# EAGLE design BUZZI-19 (EAGLE 4.15)
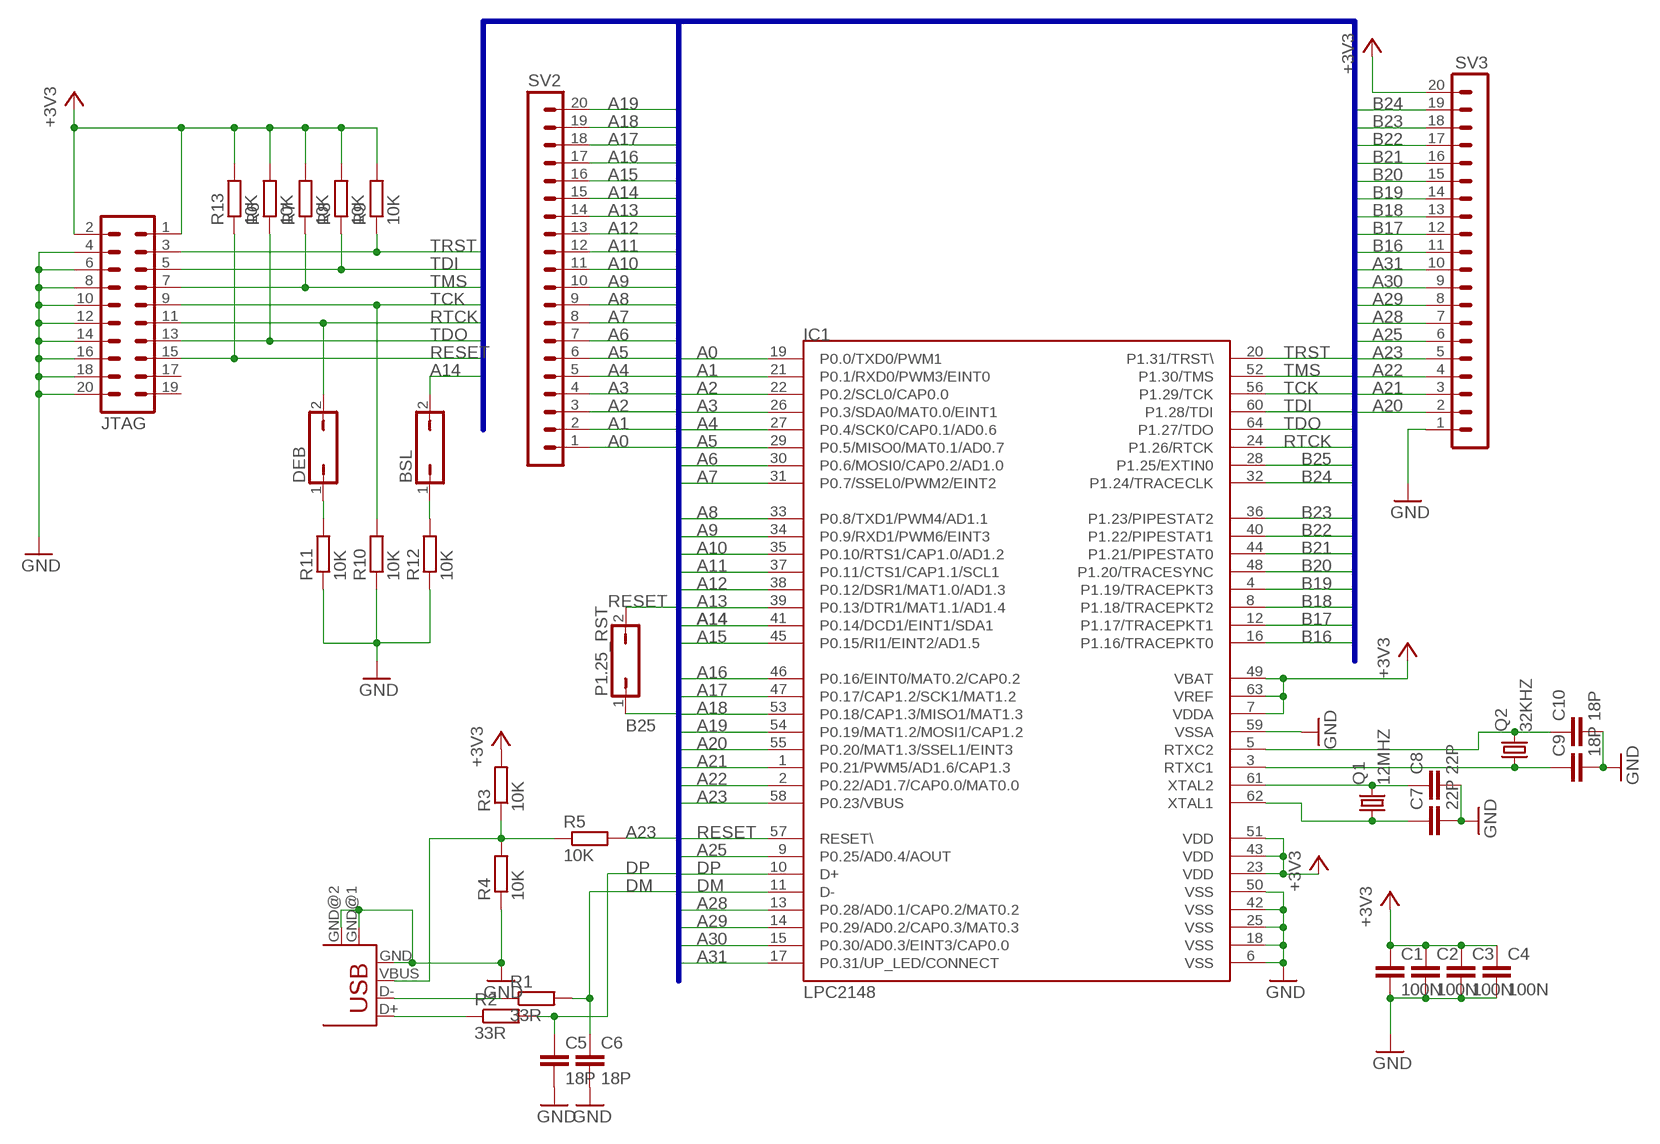
[diagram p0: schematic, sheet 1]

## Parts
BSL  JP1Q  [JP1]
C1  100N  C-EUC0805  [C0805]
C2  100N  C-EUC0805  [C0805]
C3  100N  C-EUC0805  [C0805]
C4  100N  C-EUC0805  [C0805]
C5  18P  C-EUC0805  [C0805]
C6  18P  C-EUC0805  [C0805]
C7  22P  C-EUC0805  [C0805]
C8  22P  C-EUC0805  [C0805]
C9  18P  C-EUC0805  [C0805]
C10  18P  C-EUC0805  [C0805]
DEB  JP1Q  [JP1]
IC1  LPC2148  LPC2148FBD64  [TSQFP50P1200X1200X160-64N]
JTAG  MA10-2  [MA10-2]
P1.25_RST  JP1Q  [JP1]
Q1  12MHZ  CRYTALHC49UP  [HC49UP]
Q2  32KHZ  CRYTALTC26V  [TC26V]
R1  33R  R-EU_M0805  [M0805]
R2  33R  R-EU_M0805  [M0805]
R3  10K  R-EU_M0805  [M0805]
R4  10K  R-EU_M0805  [M0805]
R5  10K  R-EU_M0805  [M0805]
R6  10K  R-EU_M0805  [M0805]
R7  10K  R-EU_M0805  [M0805]
R8  10K  R-EU_M0805  [M0805]
R9  10K  R-EU_M0805  [M0805]
R10  10K  R-EU_M0805  [M0805]
R11  10K  R-EU_M0805  [M0805]
R12  10K  R-EU_M0805  [M0805]
R13  10K  R-EU_M0805  [M0805]
SV2  MA20-1  [MA20-1]
SV3  MA20-1  [MA20-1]
USB  USB-MB-H  [USB-MB-H]

## Nets
+3V3: C1.1 C2.1 C3.1 C4.1 IC1.7(VDDA) IC1.23(VDD) IC1.43(VDD) IC1.49(VBAT) IC1.51(VDD) IC1.63(VREF) JTAG.1 JTAG.2 R3.2 R6.2 R7.2 R8.2 R9.2 R13.2 SV3.20
A0: IC1.19(P0.0/TXD0/PWM1) SV2.1
A1: IC1.21(P0.1/RXD0/PWM3/EINT0) SV2.2
A2: IC1.22(P0.2/SCL0/CAP0.0) SV2.3
A3: IC1.26(P0.3/SDA0/MAT0.0/EINT1) SV2.4
A4: IC1.27(P0.4/SCK0/CAP0.1/AD0.6) SV2.5
A5: IC1.29(P0.5/MISO0/MAT0.1/AD0.7) SV2.6
A6: IC1.30(P0.6/MOSI0/CAP0.2/AD1.0) SV2.7
A7: IC1.31(P0.7/SSEL0/PWM2/EINT2) SV2.8
A8: IC1.33(P0.8/TXD1/PWM4/AD1.1) SV2.9
A9: IC1.34(P0.9/RXD1/PWM6/EINT3) SV2.10
A10: IC1.35(P0.10/RTS1/CAP1.0/AD1.2) SV2.11
A11: IC1.37(P0.11/CTS1/CAP1.1/SCL1) SV2.12
A12: IC1.38(P0.12/DSR1/MAT1.0/AD1.3) SV2.13
A13: IC1.39(P0.13/DTR1/MAT1.1/AD1.4) SV2.14
A14: BSL.2 IC1.41(P0.14/DCD1/EINT1/SDA1) SV2.15
A15: IC1.45(P0.15/RI1/EINT2/AD1.5) SV2.16
A16: IC1.46(P0.16/EINT0/MAT0.2/CAP0.2) SV2.17
A17: IC1.47(P0.17/CAP1.2/SCK1/MAT1.2) SV2.18
A18: IC1.53(P0.18/CAP1.3/MISO1/MAT1.3) SV2.19
A19: IC1.54(P0.19/MAT1.2/MOSI1/CAP1.2) SV2.20
A20: IC1.55(P0.20/MAT1.3/SSEL1/EINT3) SV3.2
A21: IC1.1(P0.21/PWM5/AD1.6/CAP1.3) SV3.3
A22: IC1.2(P0.22/AD1.7/CAP0.0/MAT0.0) SV3.4
A23: IC1.58(P0.23/VBUS) R5.2 SV3.5
A25: IC1.9(P0.25/AD0.4/AOUT) SV3.6
A28: IC1.13(P0.28/AD0.1/CAP0.2/MAT0.2) SV3.7
A29: IC1.14(P0.29/AD0.2/CAP0.3/MAT0.3) SV3.8
A30: IC1.15(P0.30/AD0.3/EINT3/CAP0.0) SV3.9
A31: IC1.17(P0.31/UP_LED/CONNECT) SV3.10
B16: IC1.16(P1.16/TRACEPKT0) SV3.11
B17: IC1.12(P1.17/TRACEPKT1) SV3.12
B18: IC1.8(P1.18/TRACEPKT2) SV3.13
B19: IC1.4(P1.19/TRACEPKT3) SV3.14
B20: IC1.48(P1.20/TRACESYNC) SV3.15
B21: IC1.44(P1.21/PIPESTAT0) SV3.16
B22: IC1.40(P1.22/PIPESTAT1) SV3.17
B23: IC1.36(P1.23/PIPESTAT2) SV3.18
B24: IC1.32(P1.24/TRACECLK) SV3.19
B25: IC1.28(P1.25/EXTIN0) P1.25_RST.1
DM: C6.1 IC1.11(D-) R1.2
DP: C5.1 IC1.10(D+) R2.2
GND: C1.2 C2.2 C3.2 C4.2 C5.2 C6.2 C7.2 C8.2 C9.2 C10.2 IC1.6(VSS) IC1.18(VSS) IC1.25(VSS) IC1.42(VSS) IC1.50(VSS) IC1.59(VSSA) JTAG.4 JTAG.6 JTAG.8 JTAG.10 JTAG.12 JTAG.14 JTAG.16 JTAG.18 JTAG.20 R4.1 R10.1 R11.1 R12.1 SV3.1 USB.GND USB.GND@1(GND) USB.GND@2(GND)
N$2: DEB.1 R11.2
N$3: R1.1 USB.D-
N$4: R2.1 USB.D+
N$5: BSL.1 R12.2
N$14: R3.1 R4.2 R5.1 USB.VBUS
N$23: C7.1 IC1.62(XTAL1) Q1.1
N$24: C8.1 IC1.61(XTAL2) Q1.2
N$25: C9.1 IC1.3(RTXC1) Q2.1
N$26: C10.1 IC1.5(RTXC2) Q2.2
RESET: IC1.57(RESET\) JTAG.15 P1.25_RST.2 R13.1
RTCK: DEB.2 IC1.24(P1.26/RTCK) JTAG.11
TCK: IC1.56(P1.29/TCK) JTAG.9 R10.2
TDI: IC1.60(P1.28/TDI) JTAG.5 R8.1
TDO: IC1.64(P1.27/TDO) JTAG.13 R6.1
TMS: IC1.52(P1.30/TMS) JTAG.7 R7.1
TRST: IC1.20(P1.31/TRST\) JTAG.3 R9.1
Unconnected: JTAG.17 JTAG.19

## Buses
ARM7:A[0..31],B[0..31],RESET,DP,DM,TRST,TMS,TCK,TDI,TDO,RTCK

## Library data of the parts
BSL DEB P1.25_RST = jumper:JP1Q: JUMPER
C1-C10 = rcl:C-EU: CAPACITOR, European symbol
IC1 = philips-5:LPC2148
JTAG = con-lstb:MA10-2: PIN HEADER
Q1 = turbod3:CRYTAL: CRYSTAL
Q2 = crystal:CRYTAL: CRYSTAL
R1-R13 = rcl:R-EU_: RESISTOR, European symbol
SV2 SV3 = turbod3:MA20-1: PIN HEADER
USB = con-usb-2:USB: USB Connectors

## Board
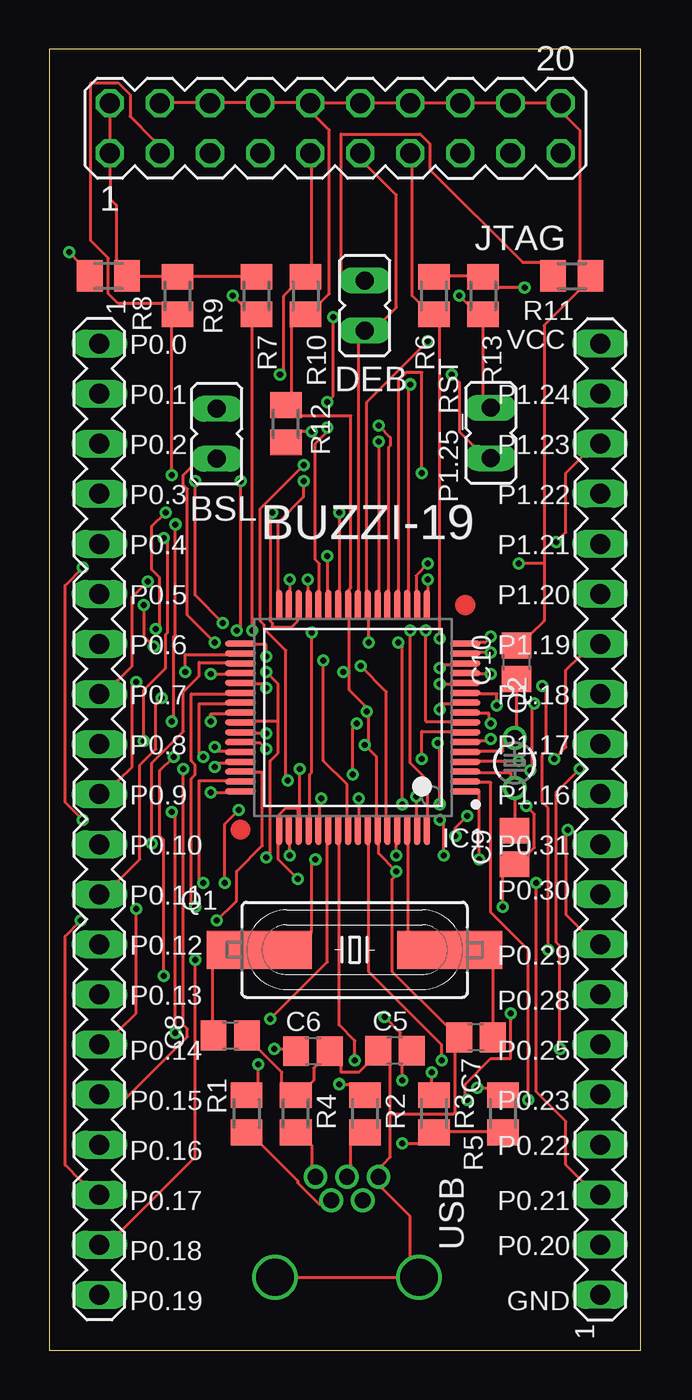
[diagram p1: board, top side]
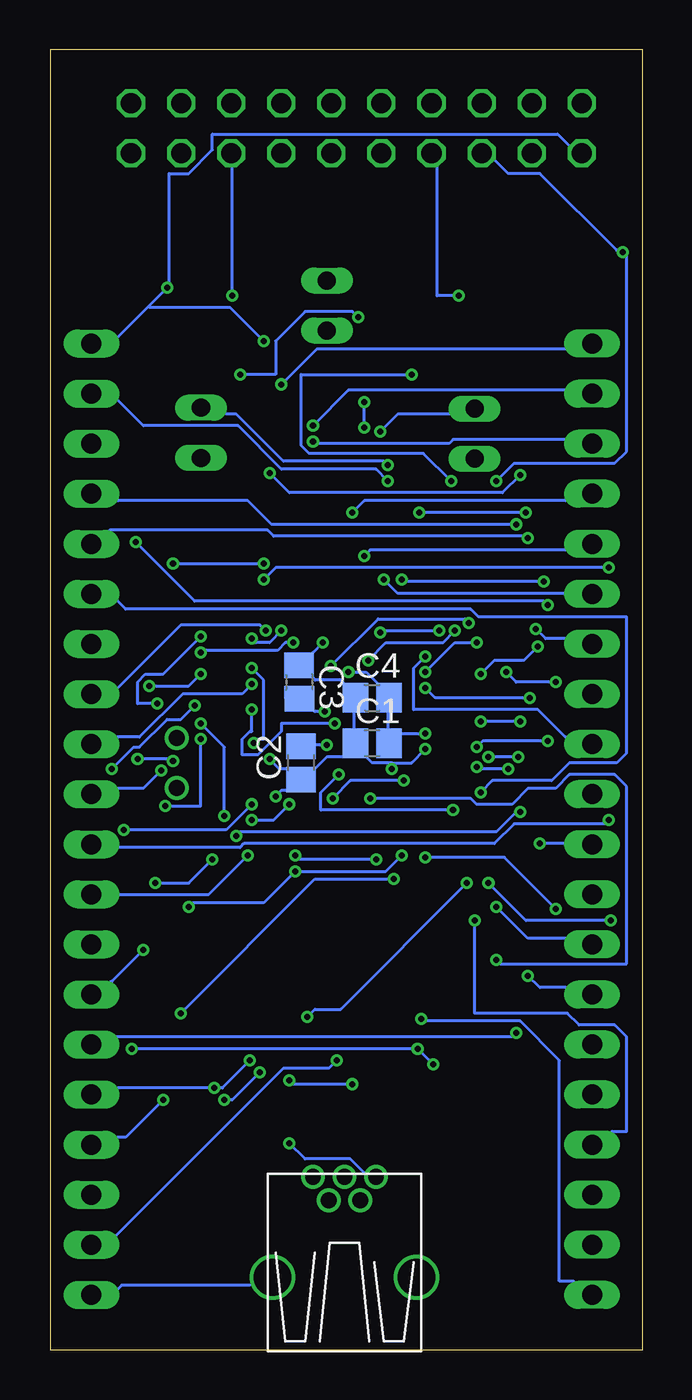
[diagram p2: board, bottom side, seen from below]

Size 30 x 66 mm. Coordinates in mm from the lower left corner, seen from the top.
Outline: 0,0 30,0 30,66 0,66 0,0
Copper layers (1*16): Top 0.035mm / dielectric 1.5mm / Bottom 0.035mm
Design rules "PCB-POOL": minimum track width 6mil, minimum drill 12mil, track to track 6mil, track to pad 6mil, pad to pad 6mil, via to via 6mil, smd to smd 6mil, copper to edge 20mil, drill to drill 8mil, minimum pad ring 8mil, minimum via ring 6mil, stop-mask expansion 3mil, vias tented up to drill 0mil, thermal gap 8mil

### Footprints (pad centres in the part's own frame; a part is rotated, then mirrored left to right if it is on the bottom)
JP1 = drill 0.914 long: 1 0,-1.27; 2 0,1.27
C0805 = smd 1.3 x 1.5: 1 -0.85,0; 2 0.85,0
TSQFP50P1200X1200X160-64N = smd 1.55 x 0.3: 1 -5.7,3.75; 2 -5.7,3.25; 3 -5.7,2.75; 4 -5.7,2.25; 5 -5.7,1.75; 6 -5.7,1.25; 7 -5.7,0.75; 8 -5.7,0.25; 9 -5.7,-0.25; 10 -5.7,-0.75; 11 -5.7,-1.25; 12 -5.7,-1.75; 13 -5.7,-2.25; 14 -5.7,-2.75; 15 -5.7,-3.25; 16 -5.7,-3.75; 33 5.7,-3.75; 34 5.7,-3.25; 35 5.7,-2.75; 36 5.7,-2.25; 37 5.7,-1.75; 38 5.7,-1.25; 39 5.7,-0.75; 40 5.7,-0.25; 41 5.7,0.25; 42 5.7,0.75; 43 5.7,1.25; 44 5.7,1.75; 45 5.7,2.25; 46 5.7,2.75; 47 5.7,3.25; 48 5.7,3.75 | smd 0.3 x 1.55: 17 -3.75,-5.7; 18 -3.25,-5.7; 19 -2.75,-5.7; 20 -2.25,-5.7; 21 -1.75,-5.7; 22 -1.25,-5.7; 23 -0.75,-5.7; 24 -0.25,-5.7; 25 0.25,-5.7; 26 0.75,-5.7; 27 1.25,-5.7; 28 1.75,-5.7; 29 2.25,-5.7; 30 2.75,-5.7; 31 3.25,-5.7; 32 3.75,-5.7; 49 3.75,5.7; 50 3.25,5.7; 51 2.75,5.7; 52 2.25,5.7; 53 1.75,5.7; 54 1.25,5.7; 55 0.75,5.7; 56 0.25,5.7; 57 -0.25,5.7; 58 -0.75,5.7; 59 -1.25,5.7; 60 -1.75,5.7; 61 -2.25,5.7; 62 -2.75,5.7; 63 -3.25,5.7; 64 -3.75,5.7
MA10-2 = drill 1.016 octagon: 1 -11.43,-1.27; 2 -11.43,1.27; 3 -8.89,-1.27; 4 -8.89,1.27; 5 -6.35,-1.27; 6 -6.35,1.27; 7 -3.81,-1.27; 8 -3.81,1.27; 9 -1.27,-1.27; 10 -1.27,1.27; 11 1.27,-1.27; 12 1.27,1.27; 13 3.81,-1.27; 14 3.81,1.27; 15 6.35,-1.27; 16 6.35,1.27; 17 8.89,-1.27; 18 8.89,1.27; 19 11.43,-1.27; 20 11.43,1.27
HC49UP = smd 5.334 x 1.93: 1 -4.826,0; 2 4.826,0
TC26V = drill 0.813 round: 1 -1.27,0; 2 1.27,0
M0805 = smd 1.3 x 1.6: 1 -0.95,0; 2 0.95,0
MA20-1 = drill 1.016 long: 1 -24.13,0; 2 -21.59,0; 3 -19.05,0; 4 -16.51,0; 5 -13.97,0; 6 -11.43,0; 7 -8.89,0; 8 -6.35,0; 9 -3.81,0; 10 -1.27,0; 11 1.27,0; 12 3.81,0; 13 6.35,0; 14 8.89,0; 15 11.43,0; 16 13.97,0; 17 16.51,0; 18 19.05,0; 19 21.59,0; 20 24.13,0
USB-MB-H = drill 0.8 round: D+ 5.1,0; D- 3.9,0.8; GND 5.1,-1.6; ID 3.9,-0.8; VBUS 5.1,1.6 | drill 1.9 round: GND@1 0,3.65; GND@2 0,-3.65

### Placement (x,y rotation side)
BSL  8.5,46.5 180 top
C1  13.7,30.8 0 bottom
C2  17.3,29.8 90 bottom
C3  17.4,33.9 270.4 bottom
C4  13.7,33.1 0 bottom
C5  17.53,15.2 180 top
C6  13.37,15.18 0 top
C7  21.64,15.87 180 top
C8  9.18,15.97 0 top
C9  23.6,25.5 270 top
C10  23.7,34.9 90 top
DEB  16,53 180 top
IC1  15.4,32.1 180 top
JTAG  14.5,62 0 top
P1.25_RST  22.38,46.54 0 top
Q1  15.48,20.31 180 top
Q2  23.6,29.8 90 top
R1  10,12 90 top
R2  16,12 90 top
R3  19.5,12 90 top
R4  12.5,12 270 top
R5  23,12 90 top
R6  19.5,53.5 90 top
R7  10.5,53.5 90 top
R8  3,54.5 0 top
R9  6.5,53.5 90 top
R10  13,53.5 90 top
R11  26.5,54.5 180 top
R12  12,47 270 top
R13  22,53.5 90 top
SV2  2.54,26.94 270 top
SV3  27.94,26.94 90 top
USB  15.1,3.7 90 top

### Tracks (layer width: path | path; a pad name or v marks a point on that pad's centre or on a via)
+3V3  (via drill 0.3)
  Top 0.152: v11,30.5 10.7,30.8 10.4,30.8 IC1.43 | v16.2,35.9 16.2,37.1 IC1.23 16.1,38.5 16.1,48.1 v19.2,51.2 | v18.6,28.1 18.6,27.1 IC1.63 | v18.9,30 18.9,31.4 20.4,31.4 IC1.7 | v19.4,14.1 19.4,13.5 R3.2 | v21.2,12.7 21.1,12.8 21.1,13.5 22.4,14.8 23.4,14.8 v23.4,17.1 | v12.6,23.9 11.6,24.9 11.6,25.7 IC1.49 11.7,27.1 11.7,27.2 12,27.5 12.6,27.5 12.6,27.1 IC1.51 12.7,27.1 v12.7,29.5 | R6.2 20.2,54.5 21.3,54.5 R13.2 22.7,53.9 v24.1,53.9 | R7.2 9.8,54.5 7.2,54.5 R9.2 5.8,54.5 R8.2 3.4,55.2 3.4,58.1 3.1,58.4 JTAG.1 3.1,61.4 3.1,62.6 JTAG.2
  Bottom 0.152: C1.1 14.6,31.5 14.6,32.4 C4.1 15.1,33.8 15.3,34 16.6,34 16.7,34.1 C3.1 16.7,35.4 v16.2,35.9 | C2.1 16.6,29.5 16,30.1 15.1,30.1 C1.1 | v11,30.5 11.7,29.8 12.7,29.8 | 12.7,29.8 13.7,29.8 14,30.1 C1.1 | v18.6,28.1 18.3,28.4 18,28.4 C2.1 | v18.9,30 18.4,29.5 18,29.5 C2.1 | v19.4,14.1 20.8,12.7 v21.2,12.7 | v23.4,17.1 16.6,23.9 v12.6,23.9 | v12.7,29.5 12.7,29.8 | 25.05,52.95 26.6,51.4 SV3.20 | 25.05,52.95 v24.1,53.9 24,54.2 24,59.7 23,59.7 21.8,60.9 21.8,61.7 4.3,61.7 3.7,61.1 JTAG.1 | v19.2,51.2 20.9,52.9 25,52.9 25.05,52.95
A0  (via drill 0.3)
  Top 0.152: v18.3,49 18.2,48.9 18.2,38.5 IC1.19
  Bottom 0.152: v18.3,49 16.5,50.8 3.9,50.8 SV2.1
A1  (via drill 0.3)
  Top 0.152: v16.7,46.9 17.3,46.3 17.3,45.9 17.2,45.8 17.2,38.5 IC1.21
  Bottom 0.152: v16.7,46.9 14.9,48.7 3.9,48.7 SV2.2
A2  (via drill 0.3)
  Top 0.152: v16.7,46.1 16.7,38.5 IC1.22
  Bottom 0.152: v16.7,46.1 16.6,46 9.8,46 9.6,46.2 3.9,46.2 SV2.3
A3  (via drill 0.3)
  Top 0.152: v14.7,42.5 14.7,38.5 IC1.26
  Bottom 0.152: v14.7,42.5 14.1,43.1 3.9,43.1 SV2.4
A4  (via drill 0.3)
  Top 0.152: v14.1,40.3 14.1,38.5 IC1.27
  Bottom 0.152: v14.1,40.3 13.8,40.6 3.9,40.6 SV2.5
A5  (via drill 0.3)
  Top 0.152: v13.1,39.1 13.1,38.5 IC1.29
  Bottom 0.152: v13.1,39.1 12.4,38.4 3.9,38.4 SV2.6
A6  (via drill 0.3)
  Top 0.152: v11.3,42.5 11.2,42.4 11.2,37 11.3,36.9 11.3,36.7 12.3,36.7 12.6,37 12.6,37.1 IC1.30 | v5.9,42.5 5.2,41.8 5.2,39.6 5.6,39.2 5.6,36.8 v5.4,36.6
  Bottom 0.152: v5.9,42.5 v11.3,42.5 | v5.4,36.6 4.9,36.1 3.9,36.1 SV2.7
A7  (via drill 0.3)
  Top 0.152: v12.2,39.1 12.2,38.5 IC1.31 | v5,39 4.2,38.2 4.2,34.7 3.5,34 SV2.8
  Bottom 0.152: v12.2,39.1 12.1,39 v5,39
A8  (via drill 0.3)
  Top 0.152: v11,35.2 11,35.8 10.4,35.8 IC1.33
  Bottom 0.152: v11,35.2 11.6,34.6 11.6,32.5 5.3,32.5 3.9,31.1 SV2.9
A9  (via drill 0.3)
  Top 0.152: v6.9,34.4 6.9,35.3 9,35.3 IC1.34 | v4.4,33.9 4.2,33.7 4.2,29.6 3.5,28.9 SV2.10
  Bottom 0.152: v6.9,34.4 6.4,33.9 v4.4,33.9
A10  (via drill 0.3)
  Top 0.152: v5.2,25.7 5.2,29.8 6.8,31.4 6.8,33.4 7.6,34.2 7.6,34.9 9,34.9 IC1.35
  Bottom 0.152: v5.2,25.7 3.9,25.7 SV2.11
A11  (via drill 0.3)
  Top 0.152: v11,33.6 11,33.8 10.4,33.8 IC1.37 | v5.7,33.1 5.4,32.8 5.4,30.5 4.6,29.7 4.6,24.9 3.5,23.8 SV2.12
  Bottom 0.152: v11,33.6 10.5,33.1 v5.7,33.1
A12  (via drill 0.3)
  Top 0.152: v7.4,22.5 7.2,22.7 7.2,29 7.4,29.2 7.4,29.7 7.2,29.9 7.2,33.3 9,33.3 IC1.38
  Bottom 0.152: v7.4,22.5 5.8,20.9 3.9,20.9 SV2.13
A13  (via drill 0.3)
  Top 0.152: v7.8,30.1 7.6,30.3 7.6,32.8 9,32.8 IC1.39 | v6.3,30.1 5.6,29.4 5.6,26.1 5.8,25.9 v5.8,19
  Bottom 0.152: v6.3,30.1 v7.8,30.1 | v5.8,19 5.2,18.4 3.9,18.4 SV2.14
A14  (via drill 0.3)
  Top 0.152: 11.6,31.9 10.4,31.9 IC1.41 | 11.6,31.9 11.6,33.8 v11,34.4 | v8.4,35.9 7,37.3 7,43.7 6.8,43.9 6.8,44.4 7.3,44.9 BSL.2 | v4.4,22.4 4.4,17.1 3.5,16.2 SV2.15 | v11,25 11.2,25.2 11.2,29.9 11.6,30.3 11.6,31.9
  Bottom 0.152: v11,34.4 9.5,35.9 v8.4,35.9 | v4.4,22.4 7,25 v11,25
A15  (via drill 0.3)
  Top 0.152: v8.4,29.6 8.4,29.8 9,29.8 IC1.45 | v6.8,29.5 6.8,16.5 7,16.3 7,15.9 3.9,12.8 SV2.16
  Bottom 0.152: v8.4,29.6 8.3,29.5 v6.8,29.5
A16  (via drill 0.3)
  Top 0.152: v8.5,21.8 9.5,22.8 9.5,24.3 10.8,25.6 10.8,29.3 10.4,29.3 IC1.46
  Bottom 0.152: v8.5,21.8 8.5,17.1 3.8,17.1 3.2,16.5 1.4,16.5 0.8,15.9 0.8,11.1 1.5,11.1 SV2.17
A17  (via drill 0.3)
  Top 0.152: v7.8,23.7 7.6,23.9 7.6,28.9 9,28.9 IC1.47 | v1.6,21.8 0.8,21 0.8,9.4 1.6,8.6 SV2.18
  Bottom 0.152: v7.8,23.7 5.9,21.8 v1.6,21.8
A18  (via drill 0.3)
  Top 0.152: v13.8,28 13.7,27.9 13.7,27.1 IC1.53 | v7.4,19.8 7.4,9.8 3.6,6 SV2.19
  Bottom 0.152: v13.8,28 8.7,28 8.4,27.7 6.6,27.7 5.8,28.5 4.4,28.5 3.7,29.2 1.4,29.2 0.8,28.6 0.8,19.6 7.2,19.6 v7.4,19.8
A19  (via drill 0.3)
  Top 0.152: v11.2,16.8 14.1,19.7 14.1,25.7 IC1.54
  Bottom 0.152: v11.2,16.8 11.1,16.7 6.2,16.7 4.2,14.7 4.2,3.5 3.5,3.5 SV2.20
A20  (via drill 0.3)
  Top 0.152: v15.5,14.7 15.5,15.7 14.7,16.5 14.7,25.7 IC1.55
  Bottom 0.152: v15.5,14.7 15.9,14.3 18.2,14.3 26.7,5.8 SV3.2
A21  (via drill 0.3)
  Top 0.152: v21.8,24.9 21.8,28.3 IC1.1 | v24.7,23.7 24.7,13.1 26.2,11.6 26.2,9.4 27,8.6 SV3.3
  Bottom 0.152: v21.8,24.9 23,23.7 v24.7,23.7
A22  (via drill 0.3)
  Top 0.152: v24.3,12.7 24.3,20.3 22.4,22.2 22.4,28.8 21.8,28.8 IC1.2
  Bottom 0.152: v24.3,12.7 26.2,10.8 26.6,10.8 SV3.4
A23  (via drill 0.3)
  Top 0.152: v19.9,14.7 19.9,15.5 16.2,19.2 16.2,25.7 IC1.58 | v21.7,13.3 22.3,13.3 R5.2
  Bottom 0.152: v19.9,14.7 21.3,13.3 v21.7,13.3 26.6,13.3 SV3.5
A25  (via drill 0.3)
  Top 0.152: v22.4,31.8 22.3,31.9 22.3,32.3 21.8,32.3 IC1.9 | v21.2,27.1 20.6,26.5 v20.6,26.1 | v6.2,27.3 6.4,27.1 v6.4,16.1
  Bottom 0.152: v22.4,31.8 21.2,30.6 v21.2,27.1 | v20.6,26.1 20.4,26.3 7.4,26.3 6.4,27.3 v6.2,27.3 | v6.4,16.1 6.6,15.9 26.7,15.9 SV3.6
A28  (via drill 0.3)
  Top 0.152: v22.4,34.3 21.8,34.3 IC1.13 | v25,33.7 25.2,33.5 25.2,30.4 25,30.2 25,27.8 25.3,27.5 v25.3,20.3
  Bottom 0.152: v22.4,34.3 23,33.7 v25,33.7 | v25.3,20.3 26.9,18.7 SV3.7
A29  (via drill 0.3)
  Top 0.152: v19.8,34.6 19.8,34.8 20.4,34.8 IC1.14 | v19.7,30.8 19.8,30.7 v19.8,27.7 | v26.3,26.4 26.2,26.3 26.2,22.1 27,21.3 SV3.8
  Bottom 0.152: v19.8,34.6 19.2,34 19.2,31 19.5,31 v19.7,30.8 | v19.8,27.7 21.1,26.4 v26.3,26.4
A30  (via drill 0.3)
  Top 0.152: v22.4,35.4 21.8,35.4 IC1.15 | v17.7,35.9 17.9,35.7 v17.9,27.7 | v19.8,26.9 20,26.7 v20,25.1
  Bottom 0.152: v22.4,35.4 22.3,35.5 18.5,35.5 18.1,35.9 v17.7,35.9 | v17.9,27.7 18.7,26.9 v19.8,26.9 | v20,25.1 22,23.1 26.6,23.1 SV3.9
A31  (via drill 0.3)
  Top 0.152: v19.2,39.1 19.2,38.5 IC1.17 | v1.7,39.7 0.8,38.8 0.8,27.8 v1.7,26.9
  Bottom 0.152: v19.2,39.1 18.6,39.7 v1.7,39.7 | v1.7,26.9 1.9,26.7 6.5,26.7 7.5,25.7 20.2,25.7 20.4,25.5 26.6,25.5 SV3.10
B16  (via drill 0.3)
  Top 0.152: v22.4,36.2 22.1,35.9 21.8,35.9 IC1.16 | v24.6,32.8 24.5,32.7 24.5,29.5 v24.4,29.4
  Bottom 0.152: v22.4,36.2 24.3,34.3 25.2,34.3 25.6,33.9 25.6,32.8 v24.6,32.8 | v24.4,29.4 25.3,28.5 26.6,28.5 SV3.11
B17  (via drill 0.3)
  Top 0.152: v19.8,33.8 20.4,33.8 IC1.12
  Bottom 0.152: v19.8,33.8 20.3,33.3 23.3,33.3 25.5,31.1 26.6,31.1 SV3.12
B18  (via drill 0.3)
  Top 0.152: v19.1,36.5 19.1,31.9 20.4,31.9 IC1.8
  Bottom 0.152: v19.1,36.5 19.4,36.8 23.4,36.8 26.6,33.6 SV3.13
B19  (via drill 0.3)
  Top 0.152: v23.8,29.9 21.8,29.9 IC1.4 | v25.6,30 26.2,30.6 26.2,34.5 26.9,35.2 SV3.14
  Bottom 0.152: v23.8,29.9 23.9,30 v25.6,30
B20  (via drill 0.3)
  Top 0.152: v8.2,28.3 9,28.3 IC1.48
  Bottom 0.152: v8.2,28.3 7.6,28.9 4.6,28.9 3.7,29.8 1.3,29.8 0.8,30.3 0.8,37.2 8.3,37.2 8.7,37.6 26.2,37.6 26.6,38 SV3.15
B21  (via drill 0.3)
  Top 0.152: v8.4,30.6 8.4,30.4 9,30.4 IC1.44 | v4.8,30.9 4.8,33.5 5.9,34.6 5.9,36.3 6,36.4 6,41 v5.8,41.2
  Bottom 0.152: v8.4,30.6 8.1,30.9 v4.8,30.9 | v5.8,41.2 5.9,41.3 18.7,41.3 19,41.6 27,41.6 SV3.16
B22  (via drill 0.3)
  Top 0.152: v8.2,31.9 8.2,32.3 9,32.3 IC1.40 | v6.2,31.9 6.3,32 6.3,36.2 6.4,36.3 v6.4,41.9
  Bottom 0.152: v6.2,31.9 v8.2,31.9 | v6.4,41.9 18.8,41.9 20,43.1 26.6,43.1 SV3.17
B23  (via drill 0.3)
  Top 0.152: v8.2,34.3 9,34.3 IC1.36 | v5.3,35.7 4.8,36.2 v4.8,37.8 | v25.7,41 26.2,41.5 26.2,44.5 27,45.3 SV3.18
  Bottom 0.152: v8.2,34.3 7.5,35 6,35 v5.3,35.7 | v4.8,37.8 5,38 22.7,38 v25.7,41
B24  (via drill 0.3)
  Top 0.152: v12.9,44.1 12.9,43.3 11.6,42 11.6,38.5 IC1.32
  Bottom 0.152: v12.9,44.1 13.5,44.7 18.3,44.7 20.5,46.9 25.3,46.9 26.6,48.2 SV3.19
B25  (via drill 0.3)
  Top 0.152: v14.1,46.8 14.1,46.6 13.5,46 13.5,40.1 13.7,39.9 13.7,38.5 IC1.28 | v14.1,48.1 14.4,48.4 v14.4,52.4 | v20.4,49.5 20.8,49.1 20.8,46.6 21.5,45.9 P1.25_RST.1
  Bottom 0.152: v14.1,46.8 v14.1,48.1 | v14.4,52.4 14.7,52.7 17.1,52.7 18.6,51.2 18.6,49.5 v20.4,49.5
DM  (via drill 0.3)
  Top 0.152: v11.4,15.3 11.9,15.3 C6.1 | v10.6,14.5 10.6,13.5 R1.2 | v22.7,32.7 22.7,33.3 21.8,33.3 IC1.11 | v26.9,29.5 25.7,28.3 25.7,20.7 25.9,20.5 v25.9,15.3
  Bottom 0.152: v10.6,14.5 v11.4,15.3 v25.9,15.3 | v22.7,32.7 23.4,32 24.1,32 25.5,30.6 25.8,30.6 v26.9,29.5
DP  (via drill 0.3)
  Top 0.152: v17.9,13.7 17.9,14.5 C5.1 17.8,15.9 17.8,16.1 v17,16.9 | v14.7,13.5 15.3,13.5 R2.2 | v19.8,32.5 19.8,32.8 20.4,32.8 IC1.10 | v15.6,31.8 15.4,31.6 v15.4,29.2 | v9.6,27.4 8.9,26.7 v8.9,23.7
  Bottom 0.152: v17.9,13.7 17.7,13.5 v14.7,13.5 | v19.8,32.5 19.8,31.4 19.9,31.4 20.3,31 20.3,30.2 19.5,30.2 18.3,31.4 18.3,31.8 v15.6,31.8 | v15.4,29.2 16.3,28.3 16.3,27.4 v9.6,27.4 | v8.9,23.7 15.3,17.3 16.6,17.3 v17,16.9
GND  (via drill 0.3)
  Top 0.152: 25.1,39.9 25.1,52 26.9,53.8 R11.1 26.9,55.2 26.9,61.9 26.2,62.6 JTAG.20 25.3,63.3 24.1,63.3 JTAG.18 22.7,63.3 21.5,63.3 JTAG.16 20.2,63.3 19,63.3 JTAG.14 17.6,63.3 16.4,63.3 JTAG.12 15.1,63.3 13.9,63.3 JTAG.10 | 25.1,39.9 25.1,37 24.4,36.3 C10.2 | v19.2,39.9 18.6,39.3 18.6,38.5 IC1.18 | 25.1,39.9 v23.8,39.9 | v11,31.3 10.4,31.3 IC1.42 | v23,22.5 23,24.1 C9.2 24.3,25.2 24.6,25.5 24.6,27.2 v24.2,27.6 | v12.2,25.1 12.2,25.7 IC1.50 | 15.2,34.4 15.2,33.5 16,32.7 v16.1,32.4 16.2,32.3 16.2,30.9 v16,30.7 16.6,30.1 16.6,27.1 IC1.59 16.7,25.7 16.7,25.2 v17.6,24.3 17.5,24 17.4,23.9 17.4,19.2 20.2,16.4 C7.2 20.6,15.2 20.6,12.1 20.5,12 17.3,12 | 15.2,34.4 15.2,37.1 IC1.25 15.2,38.5 15.2,38.6 15.3,38.7 15.3,47.4 12.7,47.4 R12.1 12.3,48.5 12.3,52 R10.1 13.7,53.1 14.2,53.6 14.2,61.9 13.5,62.6 JTAG.10 | v22.4,31 22.4,30.9 21.8,30.9 IC1.6 | 15.2,34.4 v14.9,34.4 | C8.2 10.6,15.3 11.8,14.1 11.8,13.5 R4.1 13.2,13.5 13.4,13.7 13.4,14.3 13.6,14.5 C6.2 14.8,14.5 14.8,14.1 15.7,14.1 16.1,14.5 C5.2 17.3,14.5 17.3,12 | 17.3,12 17.3,9.8 16.9,9.4 USB.GND 16.9,8.2 18.3,6.8 18.3,4.8 USB.GND@2 USB.GND@1 | JTAG.4 6.3,63.3 7.5,63.3 JTAG.6 8.8,63.3 10,63.3 JTAG.8 11.4,63.3 12.6,63.3 JTAG.10
  Bottom 0.152: v23.8,39.9 v19.2,39.9 | v11,31.3 12.3,31.3 C1.2 12.9,31.5 12.9,32.4 C4.2 13.4,33.8 14,34.4 v14.9,34.4 | v16,30.7 16.6,30.7 C2.2 | v16.1,32.4 16.6,32.4 C3.2 | v23,22.5 22.8,22.7 19.2,22.7 v17.6,24.3 13,24.3 v12.2,25.1 | v22.4,31 22.4,27.6 v24.2,27.6 | SV3.1 26.6,3.1 26.4,3.3 19.9,3.3 USB.GND@2
N$2
  Top 0.152: R11.2 25,55.2 24,55.2 19.3,59.9 19.3,61.2 18.8,61.7 14.8,61.7 14.8,54.6 DEB.1
N$3
  Top 0.152: R1.1 10.7,10.5 12.6,8.6 12.6,8.5 13.7,7.4 USB.D-
N$4
  Top 0.152: R2.1 15.3,10.5 15.3,9.4 USB.D+
N$5  (via drill 0.3)
  Top 0.152: v13.3,46.6 12.7,46.6 R12.2
  Bottom 0.152: v13.3,46.6 12.4,47.5 9.8,47.5 BSL.1
N$14  (via drill 0.3)
  Top 0.152: R5.1 22.3,11.1 20.2,11.1 R3.1 18.8,10.5 v17.9,10.5 | R4.2 13.2,10.5 13.3,10.4 13.3,9.4 USB.VBUS
  Bottom 0.152: v17.9,10.5 17.1,9.7 14.8,9.7 14.1,9 USB.VBUS
N$23
  Top 0.152: C7.1 22.5,16.6 22.5,19.4 Q1.1 18.2,21.2 18.2,25.7 IC1.62
N$24  (via drill 0.3)
  Top 0.152: C8.1 8.3,16.7 8.3,19.4 Q1.2 13.3,21.2 13.3,24.7 v13.5,24.9 | v17.6,25.1 17.6,25.7 IC1.61
  Bottom 0.152: v17.6,25.1 17.4,24.9 v13.5,24.9
N$25
  Top 0.152: C9.1 Q2.1 23.4,29.1 23.4,29.3 21.8,29.3 IC1.3
N$26
  Top 0.152: C10.1 23.7,31.6 Q2.2 23,30.9 23,30.4 21.8,30.4 IC1.5
RESET  (via drill 0.3)
  Top 0.152: v15.7,28 15.7,27.1 IC1.57 | v12.1,28.9 12,29 12,35.5 10.9,36.6 10.9,36.8 10.7,37 10.7,42.7 v12.9,44.9 | P1.25_RST.2 22,48.4 R13.1 21.3,53 v20.8,53.5
  Bottom 0.152: v15.7,28 14.8,28.9 v12.1,28.9 | v12.9,44.9 13.1,45.1 18.2,45.1 20.6,47.5 21.1,47.5 P1.25_RST.2 | v20.8,53.5 20.8,60.1 JTAG.15
RTCK
  Top 0.152: IC1.24 15.7,38.5 15.7,51.1 DEB.2 17,52.3 17.6,52.9 17.6,58.6 16.1,60.1 JTAG.11
TCK  (via drill 0.3)
  Top 0.152: v13.9,35 13.9,29.9 15.1,28.7 15.1,27.1 IC1.56 | v9.5,36.5 9.7,36.7 v9.7,44.1 | v11.7,49.5 11.9,49.7 11.9,53.5 12.3,53.9 R10.2 13.3,55 13.3,60.1 JTAG.9
  Bottom 0.152: v13.9,35 13,35.9 10.1,35.9 v9.5,36.5 | v9.7,44.1 11.1,45.5 16.9,45.5 17.3,45.9 17.3,49.5 v11.7,49.5
TDI  (via drill 0.3)
  Top 0.152: v15.8,34.7 17.1,33.4 17.1,27.1 IC1.60 | v8.8,36.9 7.4,38.3 v7.4,44.1 | 2.1,55.2 R8.1 1.5,55.2 v1,55.7
  Bottom 0.152: v15.8,34.7 13.4,37.1 9,37.1 v8.8,36.9 | v7.4,44.1 6.5,45 1.4,45 0.8,45.6 0.8,55.7 v1,55.7 1.3,55.8 5.2,59.7 6.8,59.7 7.5,60.4 JTAG.5
TDO  (via drill 0.3)
  Top 0.152: v18.3,36.5 18.3,29.8 19.2,28.9 19.2,27.1 IC1.64 | v19.8,36.1 19.8,52 R6.1 18.8,53.1 18.4,53.5 18.4,60.1 JTAG.13
  Bottom 0.152: v18.3,36.5 18.9,35.9 19.6,35.9 v19.8,36.1
TMS  (via drill 0.3)
  Top 0.152: v13.3,36.4 13.3,29.3 13.2,29.2 13.2,27.1 IC1.52 | v10.3,36.5 10.3,52 R7.1 9.8,53 v9.3,53.5
  Bottom 0.152: v13.3,36.4 13.2,36.5 v10.3,36.5 | v9.3,53.5 10.4,53.5 10.4,60.1 JTAG.7
TRST  (via drill 0.3)
  Top 0.152: v18.9,44.5 18.9,49.6 18.1,49.6 17.7,49.2 17.7,38.5 IC1.20 | v6.2,44.4 6.2,52 R9.1 5.8,53.1 3.5,53.1 3,53.6 3,55.4 2.1,56.3 2.1,64.3 3.5,64.3 4.1,63.7 4.1,62.6 5.3,61.4 JTAG.3
  Bottom 0.152: v18.9,44.5 17.9,43.5 7.1,43.5 v6.2,44.4

### Text on the board
tNames: VCC | P0.0 | P1.24 | P0.1 | P1.23 | P0.2 | P1.22 | P0.3 | BUZZI-19 | P1.21 | P0.4 | P1.20 | P0.5 | P1.19 | P0.6 | P1.18 | P0.7 | P1.17 | P0.8 | P1.16 | P0.9 | P0.31 | P0.10 | P0.30 | P0.11 | P0.29 | P0.12 | P0.13 | P0.28 | P0.25 | P0.14 | P0.23 | P0.15 | P0.22 | P0.16 | P0.21 | P0.17 | P0.20 | P0.18 | GND | P0.19